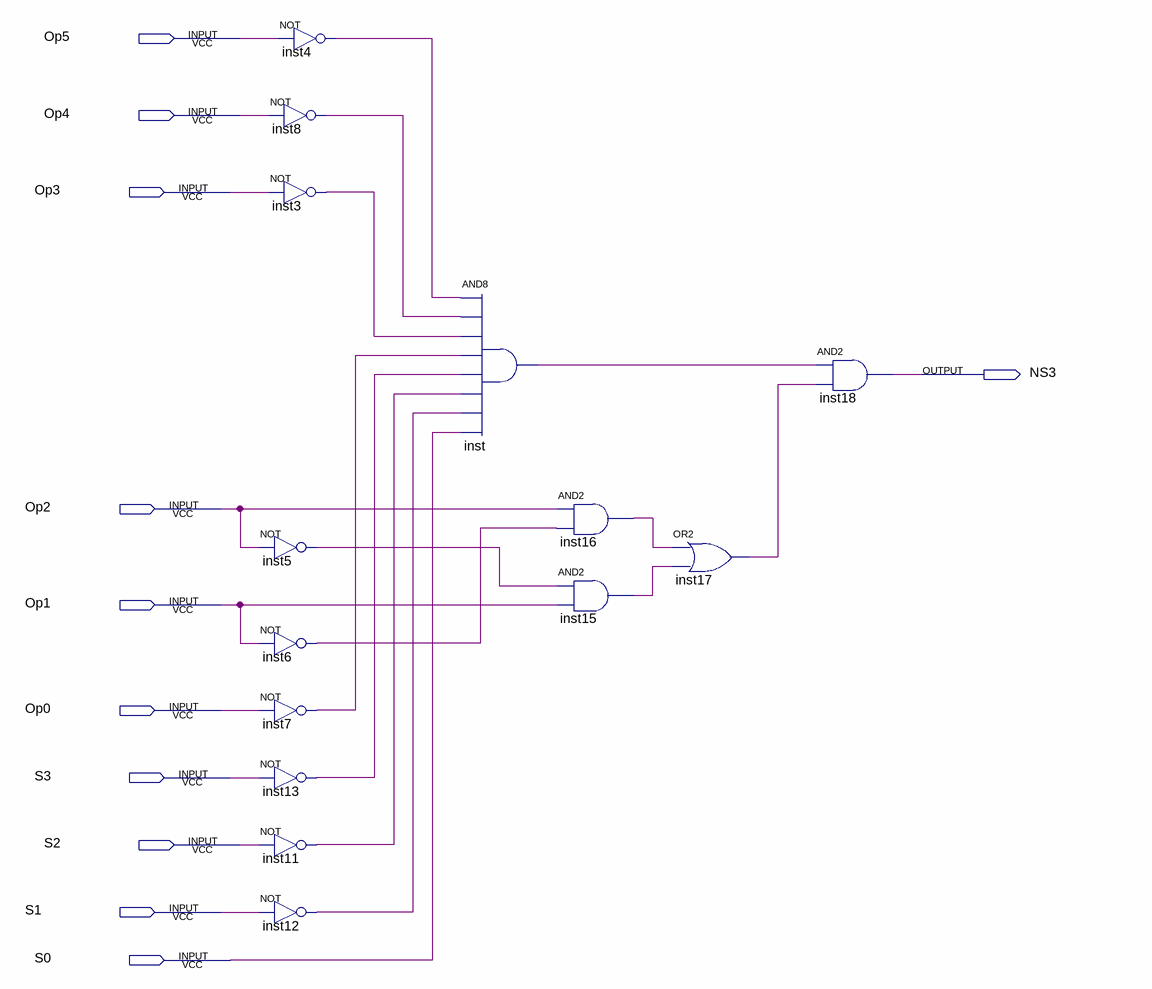
[diagram p0: schematic sheet]
// Quartus schematic NS3.bdf as structural Verilog: 14 symbols, 11 pins
module NS3 (
  input  Op5,
  input  Op4,
  input  Op3,
  input  Op2,
  input  Op1,
  input  Op0,
  input  S3,
  input  S2,
  input  S1,
  input  S0,
  output NS3
);

  wire inst3_out, inst4_out, inst5_out, inst6_out, inst7_out, inst8_out, inst11_out, inst12_out, inst13_out,
       inst15_out, inst16_out, inst17_out, inst_out;

  not inst4 (inst4_out, Op5);
  not inst8 (inst8_out, Op4);
  not inst3 (inst3_out, Op3);
  not inst5 (inst5_out, Op2);
  not inst6 (inst6_out, Op1);
  not inst7 (inst7_out, Op0);
  not inst13 (inst13_out, S3);
  not inst11 (inst11_out, S2);
  not inst12 (inst12_out, S1);
  and inst (inst_out, inst4_out, inst8_out, inst3_out, inst7_out, inst13_out, inst11_out, inst12_out, S0);
  and inst16 (inst16_out, Op2, inst6_out);
  and inst15 (inst15_out, inst5_out, Op1);
  or inst17 (inst17_out, inst16_out, inst15_out);
  and inst18 (NS3, inst_out, inst17_out);
endmodule
